# EAGLE design TP-DownHole-No2 (EAGLE 6.6.0)
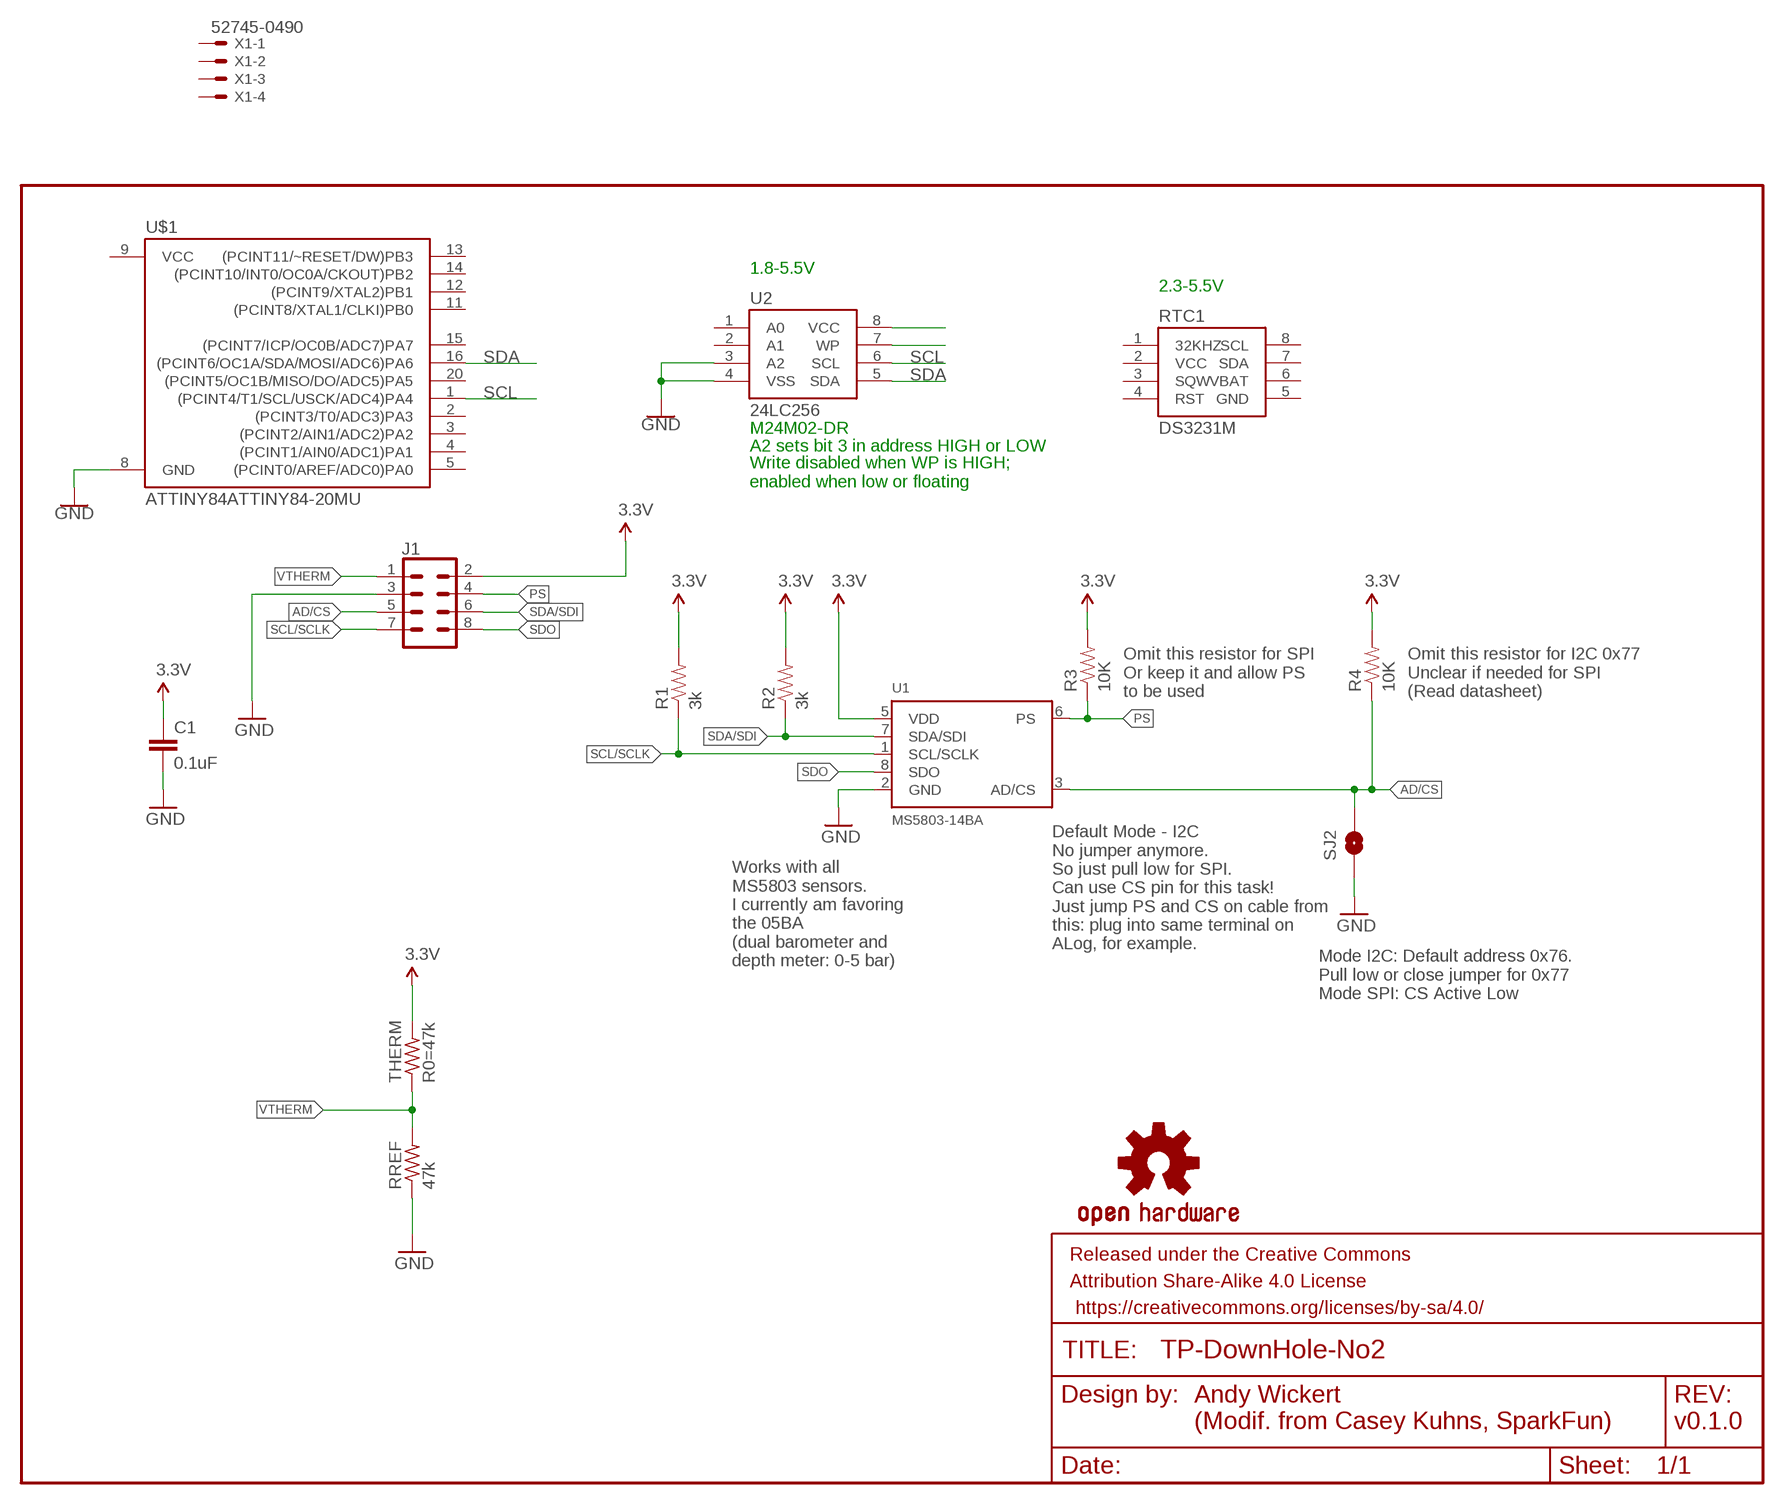
[diagram p0: schematic, sheet 1]

## Parts
C1  0.1uF  0.1UF-25V(+80/-20%)(0603)  [0603-CAP]
FRAME1  FRAME-LETTER  [CREATIVE_COMMONS]
J1  CONN_04X2  [2X4]
LOGO3  OSHW-LOGOS  [OSHW-LOGO-S]
R1  3k  2.2KOHM1/10W1%(0603)  [0603-RES]
R2  3k  2.2KOHM1/10W1%(0603)  [0603-RES]
R3  10K  10KOHM1/10W1%(0603)0603  [0603-RES]
R4  10K  10KOHM1/10W1%(0603)0603  [0603-RES]
RREF  47k  R-US_R0603  [R0603]
RTC1  DS3231M  [SO08]
SJ2  I2C-select  SOLDERJUMPERNO  [SJ_2S-NO]
THERM  R0=47k  R-US_R0603  [R0603]
U1  MS5803-14BA  [MS5803]
U2  24LC256  EEPROM-I2CSMD  [SO08]
U$1  ATTINY84ATTINY84-20MU  [QFN20]
X1  52745-0490  [52745-0490]

## Nets
3.3V: C1.1 J1.2 R1.2 R2.2 R3.2 R4.2 THERM.2 U1.5(VDD)
AD/CS: J1.5 R4.1 SJ2.2 U1.3(AD/CS)
GND: C1.2 J1.3 RREF.1 SJ2.1 U1.2(GND) U2.3(A2) U2.4(VSS) U$1.8(GND)
N$6: U2.8(VCC)
PS: J1.4 R3.1 U1.6(PS)
SCL: U2.6(SCL) U$1.1((PCINT4/T1/SCL/USCK/ADC4)PA4)
SCL/SCLK: J1.7 R1.1 U1.1(SCL/SCLK)
SDA: U2.5(SDA) U$1.16((PCINT6/OC1A/SDA/MOSI/ADC6)PA6)
SDA/SDI: J1.6 R2.1 U1.7(SDA/SDI)
SDO: J1.8 U1.8(SDO)
VTHERM: J1.1 RREF.2 THERM.1
WC: U2.7(WP)
Unconnected: RTC1.1(32KHZ) RTC1.3(SQW) RTC1.4(RST) RTC1.7(SDA) RTC1.8(SCL) U2.1(A0) U2.2(A1) U$1.2((PCINT3/T0/ADC3)PA3) U$1.3((PCINT2/AIN1/ADC2)PA2) U$1.4((PCINT1/AIN0/ADC1)PA1) U$1.5((PCINT0/AREF/ADC0)PA0) U$1.9(VCC) U$1.11((PCINT8/XTAL1/CLKI)PB0) U$1.12((PCINT9/XTAL2)PB1) U$1.13((PCINT11/~RESET/DW)PB3) U$1.14((PCINT10/INT0/OC0A/CKOUT)PB2) U$1.15((PCINT7/ICP/OC0B/ADC7)PA7) U$1.20((PCINT5/OC1B/MISO/DO/ADC5)PA5) X1.1 X1.2 X1.3 X1.4

## Notes on the sheet
- 1.8-5.5V
- 2.3-5.5V
- M24M02-DR
- A2 sets bit 3 in address HIGH or LOW
- Write disabled when WP is HIGH;
  enabled when low or floating
- Omit this resistor for SPI
  Or keep it and allow PS
  to be used
- Omit this resistor for I2C 0x77
  Unclear if needed for SPI
  (Read datasheet)
- Default Mode - I2C
  No jumper anymore.
  So just pull low for SPI.
  Can use CS pin for this task!
  Just jump PS and CS on cable from
  this: plug into same terminal on
  ALog, for example.
- Works with all
  MS5803 sensors.
  I currently am favoring
  the 05BA
  (dual barometer and
  depth meter: 0-5 bar)
- Mode I2C: Default address 0x76.
  Pull low or close jumper for 0x77
  Mode SPI: CS Active Low
- Andy Wickert
  (Modif. from Casey Kuhns, SparkFun)
- v0.1.0

## Power pins joined to a net without a drawn wire
GND: RTC1.5(GND)
VBAT: RTC1.6(VBAT)
VCC: RTC1.2(VCC)

## Library data of the parts
C1 = SparkFun-Capacitors:0.1UF-25V(+80/-20%)(0603): CAP-00810 Ceramic Standard decoupling cap; PROD_ID: CAP-00810
FRAME1 = SparkFun-Aesthetics:FRAME-LETTER: Schematic Frame Standard 8.5x11 US Letter frame
J1 = SparkFun-Connectors:CONN_04X2: Multi connection point. Often used as Generic Header-pin footprint for 0.1 inch spaced/style header connections On any of the 0.1 inch spaced packages, you can populate with these: Break Away Headers - Straight <https://www.sparkfun.com/products/116> (PRT-00116) Break Away Male Headers - Right Angle <https://www.sparkfun.com/products/553> (PRT-00553) Female Headers <https://www.sparkfun.com/products/115> (PRT-00115) Break Away Headers - Machine Pin <https://www.sparkfun.com/products/117> (PRT-00117) Break Away Female Headers - Swiss Machine Pin <https://www.sparkfun.com/products/743> (PRT-00743)
LOGO3 = SparkFun-Aesthetics:OSHW-LOGO: Open Source Hardware Logo This logo indicates the piece of hardware it is found on incorporates a OSHW license and/or adheres to the definition of open source hardware found here: http://freedomdefined.org/OSHW
R1 R2 = SparkFun-Resistors:2.2KOHM1/10W1%(0603): RES-08272; PROD_ID: RES-08272; VALUE: 2.2k
R3 R4 = SparkFun-Resistors:10KOHM1/10W1%(0603): RES-00824; PROD_ID: RES-00824
RREF THERM = rcl:R-US_: RESISTOR, American symbol
RTC1 = SparkFun-Clocks:DS3231M: DS3231M Real Time Clock Accuracy +/-5ppm. Battery Backup. 2.3V to 5.5V. Datasheet <https://cdn.sparkfun.com/datasheets/Dev/Beagle/DS3231M.pdf> SparkFun Products CryptoCape <https://www.sparkfun.com/products/12773> (DEV-12773) SparkFun CryptoShield <https://www.sparkfun.com/products/13183> (DEV-13183); PROD_ID: IC-11985
SJ2 = SparkFun-Passives:SOLDERJUMPER: Solder Jumper Standard SMD solder jumper. Used to automate production. Two varients : Normally Open and Normally Closed are the same, but have different paste layers. NC will have a large amount of paste and should jumper during reflow.
U1 = MS5803:MS5803-14BA; PROD_ID: IC-12111
U2 = SparkFun-IC-Memory:EEPROM-I2C: I2C EEPROMs, 24LC256 and others 24LC256 Series 256 kb I2C 2 Wire (32 k x 8 Bit) 2.5 V Serial EEPROM SMD - SOIC-8 Datasheet SparkFun Products SparkFun UDB5 - PIC UAV Development Board <https://www.sparkfun.com/products/11703> (GPS-11703); PROD_ID: IC-09714
U$1 = SparkFun-IC-Microcontroller:ATTINY84: Atmel 14-pin 2/4/8kB flash uC Datasheet <https://cdn.sparkfun.com/datasheets/Widgets/doc8006.pdf> SparkFun Products Tiny AVR Programmer <https://www.sparkfun.com/products/11801> (PGM-11801) SparkFun Servo Trigger - Continuous Rotation <https://www.sparkfun.com/products/13872> (WIG-13872) SparkFun Servo Trigger <https://www.sparkfun.com/products/13118> (WIG-13118)
X1 = con-molex:52745-0490: FFC/FPC-to-Board 0.50mm (.020") SMT Top Contact Right Angle, ZIF, Style Receptacle 52745 / 52435 Source: http://www.molex.com/product/ffc/52745.html; MPN: 52745-0490; OC_FARNELL: unknown; OC_NEWARK: 61H4699

## Board
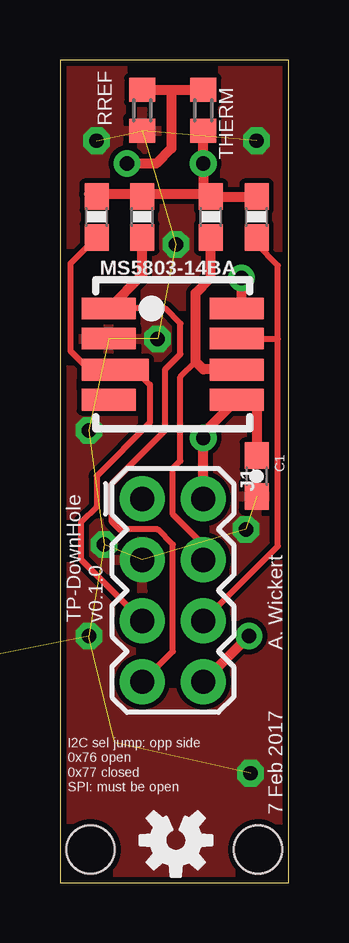
[diagram p1: board, top side]
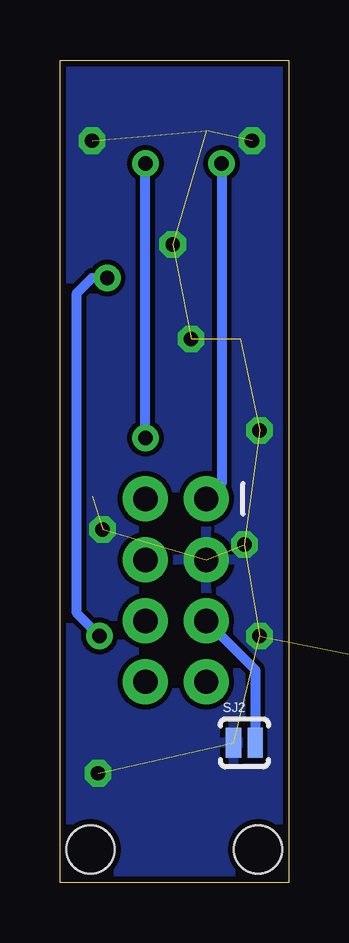
[diagram p2: board, bottom side, seen from below]

Size 9.53 x 34.29 mm. Coordinates in mm from the lower left corner, seen from the top.
Outline: 0,0 9.53,0 9.53,34.29 0,34.29 0,0
Copper layers (1*16): Top 0.035mm / dielectric 1.5mm / Bottom 0.035mm
Design rules "SparkFun": minimum track width 8mil, minimum drill 20mil, track to track 8mil, track to pad 8mil, pad to pad 8mil, via to via 8mil, smd to smd 8mil, copper to edge 10mil, drill to drill 8mil, minimum pad ring 12mil, minimum via ring 10mil, stop-mask expansion 4mil, vias tented up to drill 25mil, thermal gap 10mil
Holes 2 mm at 1.27,1.4 8.26,1.4

### Footprints (pad centres in the part's own frame; a part is rotated, then mirrored left to right if it is on the bottom)
0603-CAP = smd 1.1 x 1: 1 -0.85,0; 2 0.85,0
2X4 = drill 1.016 pad 1.88: 1 -3.81,-1.27; 2 -3.81,1.27; 3 -1.27,-1.27; 4 -1.27,1.27; 5 1.27,-1.27; 6 1.27,1.27; 7 3.81,-1.27; 8 3.81,1.27
0603-RES = smd 1.1 x 1: 1 -0.85,0; 2 0.85,0
R0603 = smd 1 x 1.1: 1 -0.85,0; 2 0.85,0
SO08 = smd 0.6 x 1.2: 1 -1.905,-2.8; 2 -0.635,-2.8; 3 0.635,-2.8; 4 1.905,-2.8; 5 1.905,2.8; 6 0.635,2.8; 7 -0.635,2.8; 8 -1.905,2.8
SJ_2S-NO = smd 0.635 x 1.27: 1 -0.45,0; 2 0.45,0
MS5803 = smd 2.25 x 0.9: 1 -2.675,1.9; 2 -2.675,0.65; 4 -2.675,-1.9; 5 2.675,-1.9; 6 2.675,-0.65; 7 2.675,0.65; 8 2.675,1.9 | smd 2.8 x 0.9: 3 -2.4,-0.65
QFN20 = smd 1 x 1: 0 0,0 | smd 0.65 x 0.3: 1 -1.9,1; 2 -1.9,0.5; 3 -1.9,0; 4 -1.9,-0.5; 5 -1.9,-1; 11 1.9,-1; 12 1.9,-0.5; 13 1.9,0; 14 1.9,0.5; 15 1.9,1 | smd 0.3 x 0.65: 6 -1,-1.9; 7 -0.5,-1.9; 8 0,-1.9; 9 0.5,-1.9; 10 1,-1.9; 16 1,1.9; 17 0.5,1.9; 18 0,1.9; 19 -0.5,1.9; 20 -1,1.9
52745-0490 = smd 0.3 x 0.8: 1 -0.75,2.5; 2 -0.25,2.5; 3 0.25,2.5; 4 0.75,2.5

### Placement (x,y rotation side)
C1  8.19,16.95 270 top
FRAME1  -20.83,52.7 0 top  (outside the outline)
J1  4.7,12.19 270 top
LOGO3  4.83,1.78 180 top
R1  3.43,27.75 90 top
R2  8.19,27.75 90 top
R3  6.29,27.75 90 top
R4  1.52,27.75 90 top
RREF  3.43,32.19 90 top
RTC1  -45.85,-11.18 0 top  (outside the outline)
SJ2  1.84,5.84 0 bottom
THERM  5.97,32.19 270 top
U1  4.7,22.03 0 top
U2  -45.85,-4.06 0 top  (outside the outline)
U$1  -44.07,3.17 0 top  (outside the outline)
X1  -54.48,-8.51 0 top  (outside the outline)

### Tracks (layer width: path | path; a pad name or v marks a point on that pad's centre or on a via)
3.3V  (via drill 0.6)
  Top 0.406: J1.2 v5.97,18.54 5.97,18.73 U1.5 7.56,20.13 8.19,20.13 C1.1 | THERM.2 v5.97,29.97 5.97,28.7 | R2.2 R3.2 5.97,28.7 | 5.97,28.7 3.11,28.7 | 3.11,28.7 1.21,28.7 R4.2 | 3.11,28.7 R1.2
  Bottom 0.406: v5.97,18.54 v5.97,29.97
AD/CS
  Top 0.254: U1.3 3.13,21.38 3.75,20.77 3.75,19.18 1.52,16.95 1.52,15.68 0.89,15.05 0.89,13.46 J1.5 | U1.3 2.17,21.38 2.16,21.4 | U1.3 1.54,21.38 1.52,21.4 1.21,21.4 0.45,22.16 0.45,25.82 R4.1
  Bottom 0.406: J1.5 1.39,8.88 SJ2.2
GND  (via drill 0.6)  (17 unrouted)
  other vias: 4.06,22.67 7.94,4.57 7.75,14.73 1.52,30.92 1.21,10.29 1.21,18.86 1.84,14.1 8.19,30.92 4.83,26.61
  pour Top: -0.7,35.05 10.73,35.05 10.73,-0.32 -0.7,-0.32
  pour Bottom: 10.73,35.05 10.73,-0.32 -0.7,-0.32 -0.7,35.05
PS
  Top 0.254: 5.65,21.72 5.02,21.08 5.02,17.59 4.7,17.27 4.7,15.37 5.97,14.1 J1.4
  Top 0.406: U1.6 7.36,21.4 5.97,21.4 5.65,21.72 5.65,24.57 6.29,25.21 R3.1
SCL  (1 unrouted)
SCL/SCLK
  Top 0.254: J1.7 4.7,9.65 4.7,14.1 4.06,14.73 2.48,14.73 2.16,15.05 2.16,16.64 4.38,18.86 4.38,21.4 5.02,22.04 5.02,23.3 4.38,23.94 2.16,23.94 U1.1
  Top 0.406: U1.1 3.43,25.34 R1.1
SDA  (1 unrouted)
SDA/SDI
  Top 0.254: J1.6 9.08,14.03 9.08,22.67 | 9.08,22.67 9.08,25.72 8.19,26.61 R2.1 | 7.39,22.67 9.08,22.67
  Top 0.406: U1.7 7.39,22.67
SDO  (via drill 0.6)
  Top 0.406: v7.56,25.21 7.56,23.94 U1.8 | J1.8 v7.87,10.29
  Bottom 0.406: v7.56,25.21 8.19,25.21 8.83,24.57 8.83,11.24 v7.87,10.29
VTHERM  (via drill 0.6)
  Top 0.406: 4.64,33.04 THERM.1 | RREF.2 4.64,33.04 | 4.64,33.04 4.64,30.61 4,29.97 v2.79,29.97
  Bottom 0.406: v2.79,29.97 2.79,16.64 J1.1

### Text on the board
tPlace: TP-DownHole / v0.1.0 | A. Wickert | I2C sel jump: opp side / 0x76 open / 0x77 closed / SPI: must be open | 7 Feb 2017
Reference: Andrew D. Wickert